# Altium schematic sheet PowerSupplay.SchDoc
size A4
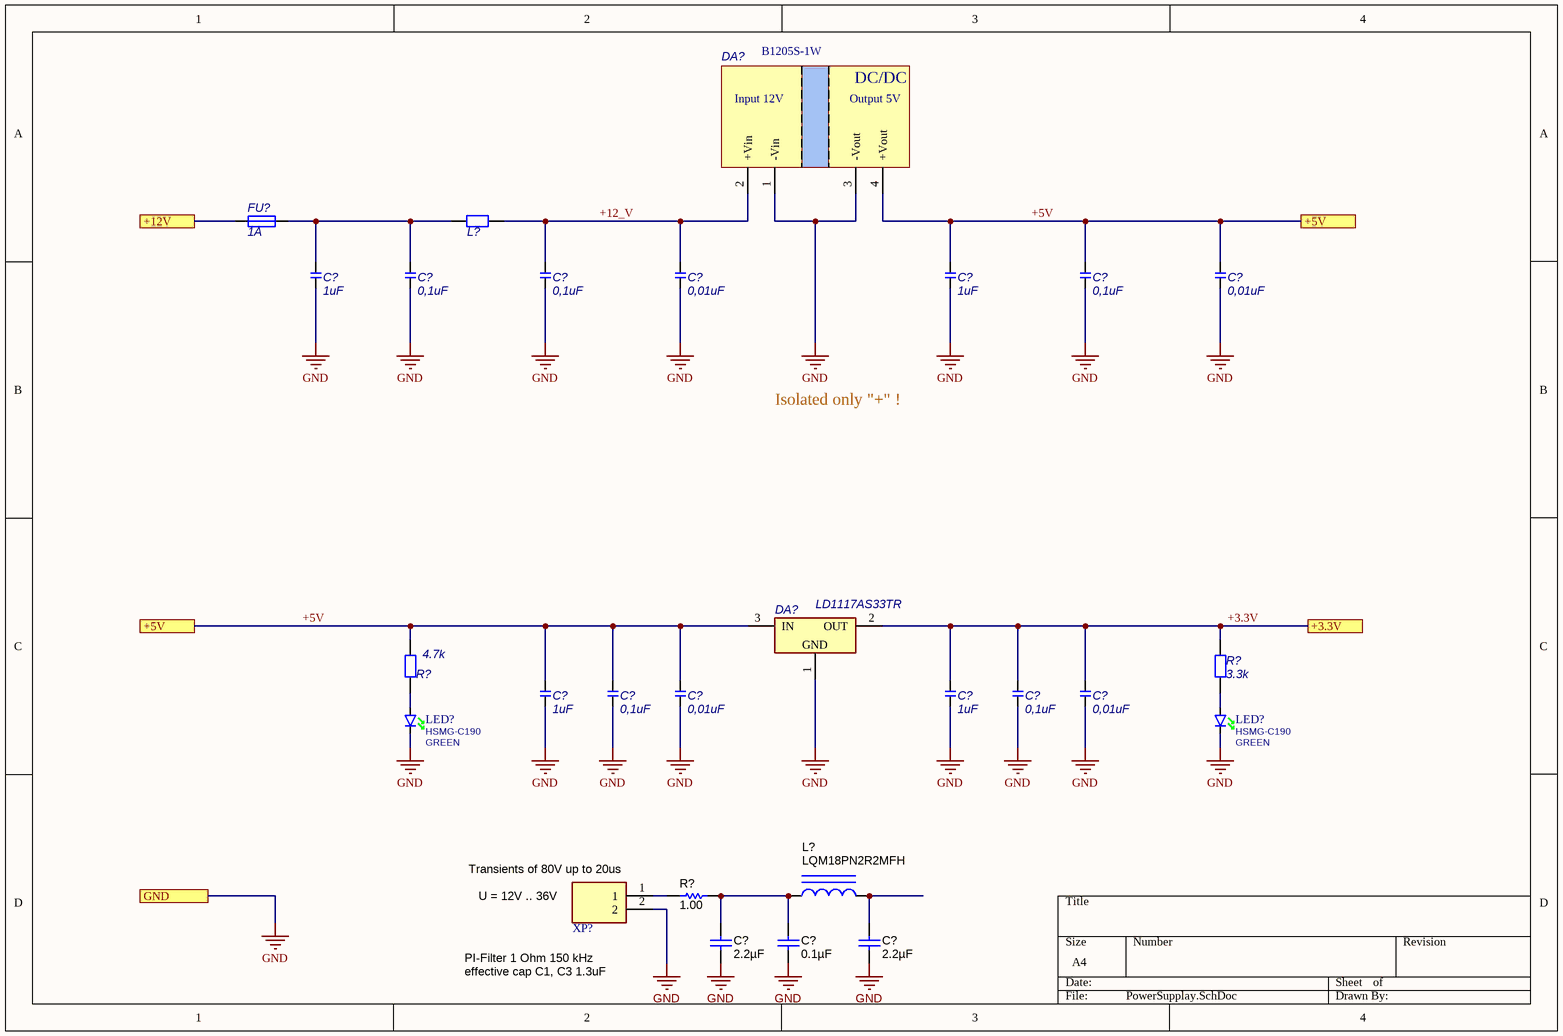
[diagram p0: PowerSupplay.SchDoc]

## Parts
(Parts that share a designator on the sheet are numbered #1, #2 ... from top to bottom, then left to right.)
C?#1  1uF  [SMD1206-v1]
C?#2  0,1uF  [SMD1206-v1]
C?#3  0,1uF  [SMD1206-v1]
C?#4  0,01uF  [SMD1206-v1]
C?#5  1uF  [SMD1206-v1]
C?#6  0,1uF  [SMD1206-v1]
C?#7  0,01uF  [SMD1206-v1]
C?#8  1uF  [SMD1206-v1]
C?#9  0,1uF  [SMD1206-v1]
C?#10  0,01uF  [SMD1206-v1]
C?#11  1uF  [SMD1206-v1]
C?#12  0,1uF  [SMD1206-v1]
C?#13  0,01uF  [SMD1206-v1]
C?#14  ValueDisplayed: 2.2µF  [1206_033]  (hidden comment: UMK316B7225KD-T)
C?#15  ValueDisplayed: 0.1µF  [0603]  (hidden comment: C1608X7R1H104K)
C?#16  ValueDisplayed: 2.2µF  [1206_033]  (hidden comment: UMK316B7225KD-T)
DA?#1  (no value)  [B1205S-1W]
DA?#2  LD1117AS33TR  [SOT-223_1]
FU?  1A  [SMD1206-v1]
L?#1  0  [SMD1206-v1]  (value not drawn)
L?#2  LQM18PN2R2MFH  [0603]
LED?#1  Manufacturer Part No.: HSMG-C190  Color: GREEN  [LEDC1608X80N_G]  (hidden comment: LED)
LED?#2  Manufacturer Part No.: HSMG-C190  Color: GREEN  [LEDC1608X80N_G]  (hidden comment: LED)
R?#1  4.7k  [SMD1206-v1]
R?#2  3.3k  [SMD1206-v1]
R?#3  ValueDisplayed: 1.00  [0603]  (hidden comment: CRCW06031R00FKEA)
XP?  TB006-508-02BE  [CUI_TB006-508-02BE]  (value not drawn)

## Ports
+3.3V, +5V, +12V, GND

## Nets
GND: C?#1.1 C?#2.1 C?#3.1 C?#4.1 C?#5.1 C?#6.1 C?#7.1 C?#8.1 C?#9.1 C?#10.1 C?#11.1 C?#12.1 C?#13.1 C?#14.2 C?#15.2 C?#16.2 DA?#1.1(-Vin) DA?#1.3(-Vout) DA?#2.1(GND) LED?#1.1(K) LED?#2.1(K) XP?.2 ; port GND
+3.3V: C?#11.2 C?#12.2 C?#13.2 DA?#2.2(OUT) R?#2.2 ; port +3.3V
+5V: C?#5.2 C?#6.2 C?#7.2 C?#8.2 C?#9.2 C?#10.2 DA?#1.4(+Vout) DA?#2.3(IN) R?#1.2 ; port +5V
+12_V: C?#3.2 C?#4.2 DA?#1.2(+Vin) L?#1.1
+12V: FU?.1 ; port +12V
NetC?#1_2: C?#1.2 C?#2.2 FU?.2 L?#1.2
NetC?#14_1: C?#14.1 C?#15.1 L?#2.1 R?#3.1
NetC?#16_1: C?#16.1 L?#2.2
NetLED?#1_2: LED?#1.2(A) R?#1.1
NetLED?#2_2: LED?#2.2(A) R?#2.1
NetR?#3_2: R?#3.2 XP?.1

## Notes on the sheet
- Isolated only "+" !
- U = 12V .. 36V
- (near XP?) Transients of 80V up to 20us
- (near XP?) PI-Filter 1 Ohm 150 kHz
  effective cap C1, C3 1.3uF
- (in symbol B1205S-1W) DC/DC; Input 12V; Output 5V

## Library data of the parts
C?#1 C?#5 C?#8 C?#11 = SMD1206-1uF-50V: Конденсатор неполярный; Manufacturer: AVX; Power\Voltage: 50V; Ведомость покупных: Y; Author: Sun; Part Number: SMD1206-1uF-50V; DateModification: 11.10.2016; ManufacturerPartNumber: *; Value: 1uF; Tolerance: *; TKE: *; Корпус: SMD1206; TU/GOST: *; Примечание: *; Rem: *; SpecificationName: Конденсатор; ComponentLink1Description: Параметры; ComponentLink1URL: *; ComponentLink2Description: Сайт производителя; ComponentLink2URL: http://www.avx.com/; Component Type: Standard; Component Kind: Standard
C?#2 C?#3 C?#6 C?#9 C?#12 = SMD1206-0.1uF-50V: Конденсатор неполярный; Manufacturer: AVX; Power\Voltage: 50V; Ведомость покупных: Y; Author: Sun; Part Number: SMD1206-0.1uF-50V; DateModification: 11.10.2016; ManufacturerPartNumber: *; Value: 0,1uF; Tolerance: *; TKE: *; Корпус: SMD1206; TU/GOST: *; Примечание: *; Rem: *; SpecificationName: Конденсатор; ComponentLink1Description: Параметры; ComponentLink1URL: *; ComponentLink2Description: Сайт производителя; ComponentLink2URL: http://www.avx.com/; Component Type: Standard; Component Kind: Standard
C?#4 C?#7 C?#10 C?#13 = SMD1206-0.01uF-50V: Конденсатор неполярный; Manufacturer: AVX; Power\Voltage: 50V; Ведомость покупных: Y; Author: Sun; Part Number: SMD1206-0.01uF-50V; DateModification: 11.10.2016; ManufacturerPartNumber: *; Value: 0,01uF; Tolerance: *; TKE: *; Корпус: SMD1206; TU/GOST: *; Примечание: *; Rem: *; SpecificationName: Конденсатор; ComponentLink1Description: Параметры; ComponentLink1URL: *; ComponentLink2Description: Сайт производителя; ComponentLink2URL: http://www.avx.com/; Component Type: Standard; Component Kind: Standard
C?#14 C?#16 = UMK316B7225KD-T: CAP, CERM, 2.2 µF, 50 V, +/- 10%, X7R, 1206; Manufacturer: Taiyo Yuden; Polarized: N; CompType: Capacitor; Value: 2.2uF; U/M: EA; Cap_F: 0.0000022; Tolerance_%: 10; Value1: Unknown; VDC_V: 50; Value2: 50V; TaMin_C: -55; TaMax_C: 125; Cap_Case: 1206; SymbolVersion: 2008-07-09; PartNumber: UMK316B7225KD-T; PackageReference: 1206; RoHS: Y; MountType: SMT; Technology: Ceramic; TempCo: X7R; Published: 2008-06-19; Publisher: Texas Instruments; LatestRevisionDate: 2014-11-14; ComponentLink1Description: Datasheet link; ComponentLink1URL: http://www.yuden.co.jp/or/product/category/capacitor/UMK316B7225KL-T.pdf; Supplier 1: Digi-Key; Supplier Part Number 1: 587-3168-1-ND
C?#15 = C1608X7R1H104K: CAP, CERM, 0.1 µF, 50 V, +/- 10%, X7R, 0603; Manufacturer: TDK; Polarized: N; CompType: Capacitor; Value: 0.1uF; U/M: EA; Cap_F: 0.0000001; Tolerance_%: 10; ESR_ohm: 0.017; Value1: 0.017 ohm; VDC_V: 50; Value2: 50V; TaMin_C: -55; TaMax_C: 125; SymbolVersion: 2008-07-09; PartNumber: C1608X7R1H104K; PackageReference: 0603; RoHS: Y; MountType: SMT; Technology: Ceramic; TempCo: X7R; Cap_Case: 0603; Published: 2008-06-19; Publisher: Texas Instruments; LatestRevisionDate: 2014-11-24; ComponentLink1Description: Datasheet link; ComponentLink1URL: http://www.tdk.co.jp/tefe02/e412_c.pdf; Supplier 1: Digi-Key; Supplier Part Number 1: 445-1314-1-ND; Supplier 2: Farnell; Supplier Part Number 2: 1118182
DA?#1 = B1205S-1W: Input +12V, Output +5V, P=1W, Isolation; Корпус: SIP-4; SpecificationName: ISO Power Module; ComponentLink1Description: *; ComponentLink1URL: *; ComponentLink2Description: *; ComponentLink2URL: *; Manufacturer: *; Power\Voltage: *; Rem: *; TKE: *; Tolerance: *; TU/GOST: *; Примечание: *; Author: Sun; DateModification: 14.02.2022; Value: *; Part Number: B1205S-1W
DA?#2 = LD1117AS33TR: Low Drop 3,3V; Manufacturer: STM; Корпус: SOT-223; SpecificationName: Регулятор напряжения; ComponentLink1Description: Параметры; ComponentLink1URL: *; ComponentLink2Description: Сайт производителя; ComponentLink2URL: *; Power\Voltage: *; Rem: *; TKE: *; Tolerance: *; TU/GOST: *; Примечание: *; Author: Gr.; DateModification: 14.03.2011; Value: *; ManufacturerPartNumber: LD1117AS33TR; Part Number: LD1117AS33TR
FU? = Fuse_1A: SpecificationName: Предохранитель; ComponentLink1Description: Параметры; ComponentLink1URL: *; ComponentLink2Description: Сайт производителя; ComponentLink2URL: *; Manufacturer: *; Power\Voltage: *; Rem: *; TKE: *; Tolerance: *; TU/GOST: *; Корпус: *; Примечание: *; Author: Sun; DateModification: 16.02.2022; ManufacturerPartNumber: *; Value: 1A; Part Number: Fuse_1A; Package: 1206
L?#1 = SMD1206-0: Резистор постоянный; Manufacturer: Rohm Semiconductor; Ведомость покупных: Y; Author: Sun; Part Number: SMD1206-0; DateModication: 12.10.2016; ManufacturerPartNumber: *; Value: 0; Tolerance: *; Power\Voltage: *; TKE: *; Корпус: SMD1206; TU/GOST: *; Примечание: *; Rem: *; SpecificationName: Резистор; ComponentLink1Description: Параметры; ComponentLink1URL: *; ComponentLink2Description: Сайт производителя; ComponentLink2URL: http://www.royalohm.com/; Component Type: Standard; Component Kind: Standard
L?#2 = LQM18PN2R2MFH: Inductor, Ferrite, 2.2 µH, 0.35 A, 0.38 ohm, SMD; Manufacturer: MuRata; Value: 2.2uH; Imax_A: 0.35; DCR_ohm: 0.38; Value2: 0.35A; Ind_H: 2.2E-6; ValueDisplayed: 2.2µH; Irms: 0.9A @ 40C rise; Isat: 0.35A @ 30% inductance drop; CompType: Inductor; SymbolVersion: 2008-07-23; PartNumber: LQM18PN2R2MFH; Value1: 0.38 ohm; MountType: SMT; PackageReference: 0603; Published: 2008-06-26; Publisher: Texas Instruments; LatestRevisionDate: 2014-11-24; ComponentLink1Description: Datasheet link; ComponentLink1URL: https://sps06.itg.ti.com/sites/KMS/crossdivteams/altium/docs/ComponentDatasheets/Murata Power Inductor Product Update_2013 July.pdf; RoHS: Y; Supplier 1: Digi-Key; Supplier Part Number 1: 490-9571-1-ND; Material: Ferrite
LED?#1 LED?#2 = LED-Avago-HSMG-C190_Green: Surface mount LED green 20mA; Manufacturer Name: Avago; Part Number: LED-Avago-HSMG-C190_Green; ManufacturerPartNumber: LED-Avago-HSMG-C190_Green
R?#1 = SMD1206-4.7k-1%: Резистор постоянный; Manufacturer: Rohm Semiconductor; Tolerance: 1%; Ведомость покупных: Y; Author: Sun; Part Number: SMD1206-4.7k-1%; DateModication: 12.10.2016; ManufacturerPartNumber: *; Value: 4.7k; Power\Voltage: *; TKE: *; Корпус: SMD1206; TU/GOST: *; Примечание: *; Rem: *; SpecificationName: Резистор; ComponentLink1Description: Параметры; ComponentLink1URL: *; ComponentLink2Description: Сайт производителя; ComponentLink2URL: http://www.royalohm.com/; Component Type: Standard; Component Kind: Standard
R?#2 = SMD1206-3.3k-1%: Резистор постоянный; Manufacturer: Rohm Semiconductor; Tolerance: 1%; Ведомость покупных: Y; Author: Sun; Part Number: SMD1206-3.3k-1%; DateModication: 12.10.2016; ManufacturerPartNumber: *; Value: 3.3k; Power\Voltage: *; TKE: *; Корпус: SMD1206; TU/GOST: *; Примечание: *; Rem: *; SpecificationName: Резистор; ComponentLink1Description: Параметры; ComponentLink1URL: *; ComponentLink2Description: Сайт производителя; ComponentLink2URL: http://www.royalohm.com/; Component Type: Standard; Component Kind: Standard
R?#3 = CRCW06031R00FKEA: RES, 1.00, 1%, 0.1 W, 0603; Manufacturer: Vishay-Dale; CompType: Resistor; Value: 1.00; Res_ohm: 1; Value_Code: 1R00; Power_W: 0.1; Value2: 0.1W; VDC_V: 75; TempCo: 100 ppm/C; EIA_Code: E96; U/M: EA; SymbolVersion: 2009-05-29; PartNumber: CRCW06031R00FKEA; PackageReference: 0603; RoHS: Y; Tolerance_%: 1; Value1: 1%; MountType: SMT; Technology: Thick Film; Published: 2008-06-26; Publisher: Texas Instruments; LatestRevisionDate: 2014-10-21; ComponentLink1Description: Datasheet link; ComponentLink1URL: http://www.vishay.com/docs/20035/dcrcwe3.pdf; Supplier 1: Digi-Key; Supplier Part Number 1: 541-1.00HHCT-ND; Supplier 2: Farnell; Supplier Part Number 2: 1616871; Supplier 3: Newark; Supplier Part Number 3: 52K8059
XP? = TB006-508-02BE: MF: CUI Devices; SpecificationName: Connector; Value: *; MP: TB006-508-02BE; SnapEDA_Link: https://www.snapeda.com/parts/TB006-508-02BE/CUI%20Devices/view-part/3591097/?ref=snap; Availability: Unavailable; Package: None; Price: None; CUI_purchase_URL: https://www.cuidevices.com/product/interconnect/connectors/terminal-blocks/tb006-508-series?utm_source=snapeda.com&utm_medium=referral&utm_campaign=snapedaBOM; Part Number: TB006-508-02BE; DateModification: 08.10.2021; ManufacturerPartNumber: TB006-508-02BE; Tolerance: *; Power\Voltage: *; TKE: *; Корпус: *; TU/GOST: *; Примечание: *; Rem: *; ComponentLink1Description: Parametrs